# EAGLE design nixie_without_colon (EAGLE 7.7.0)
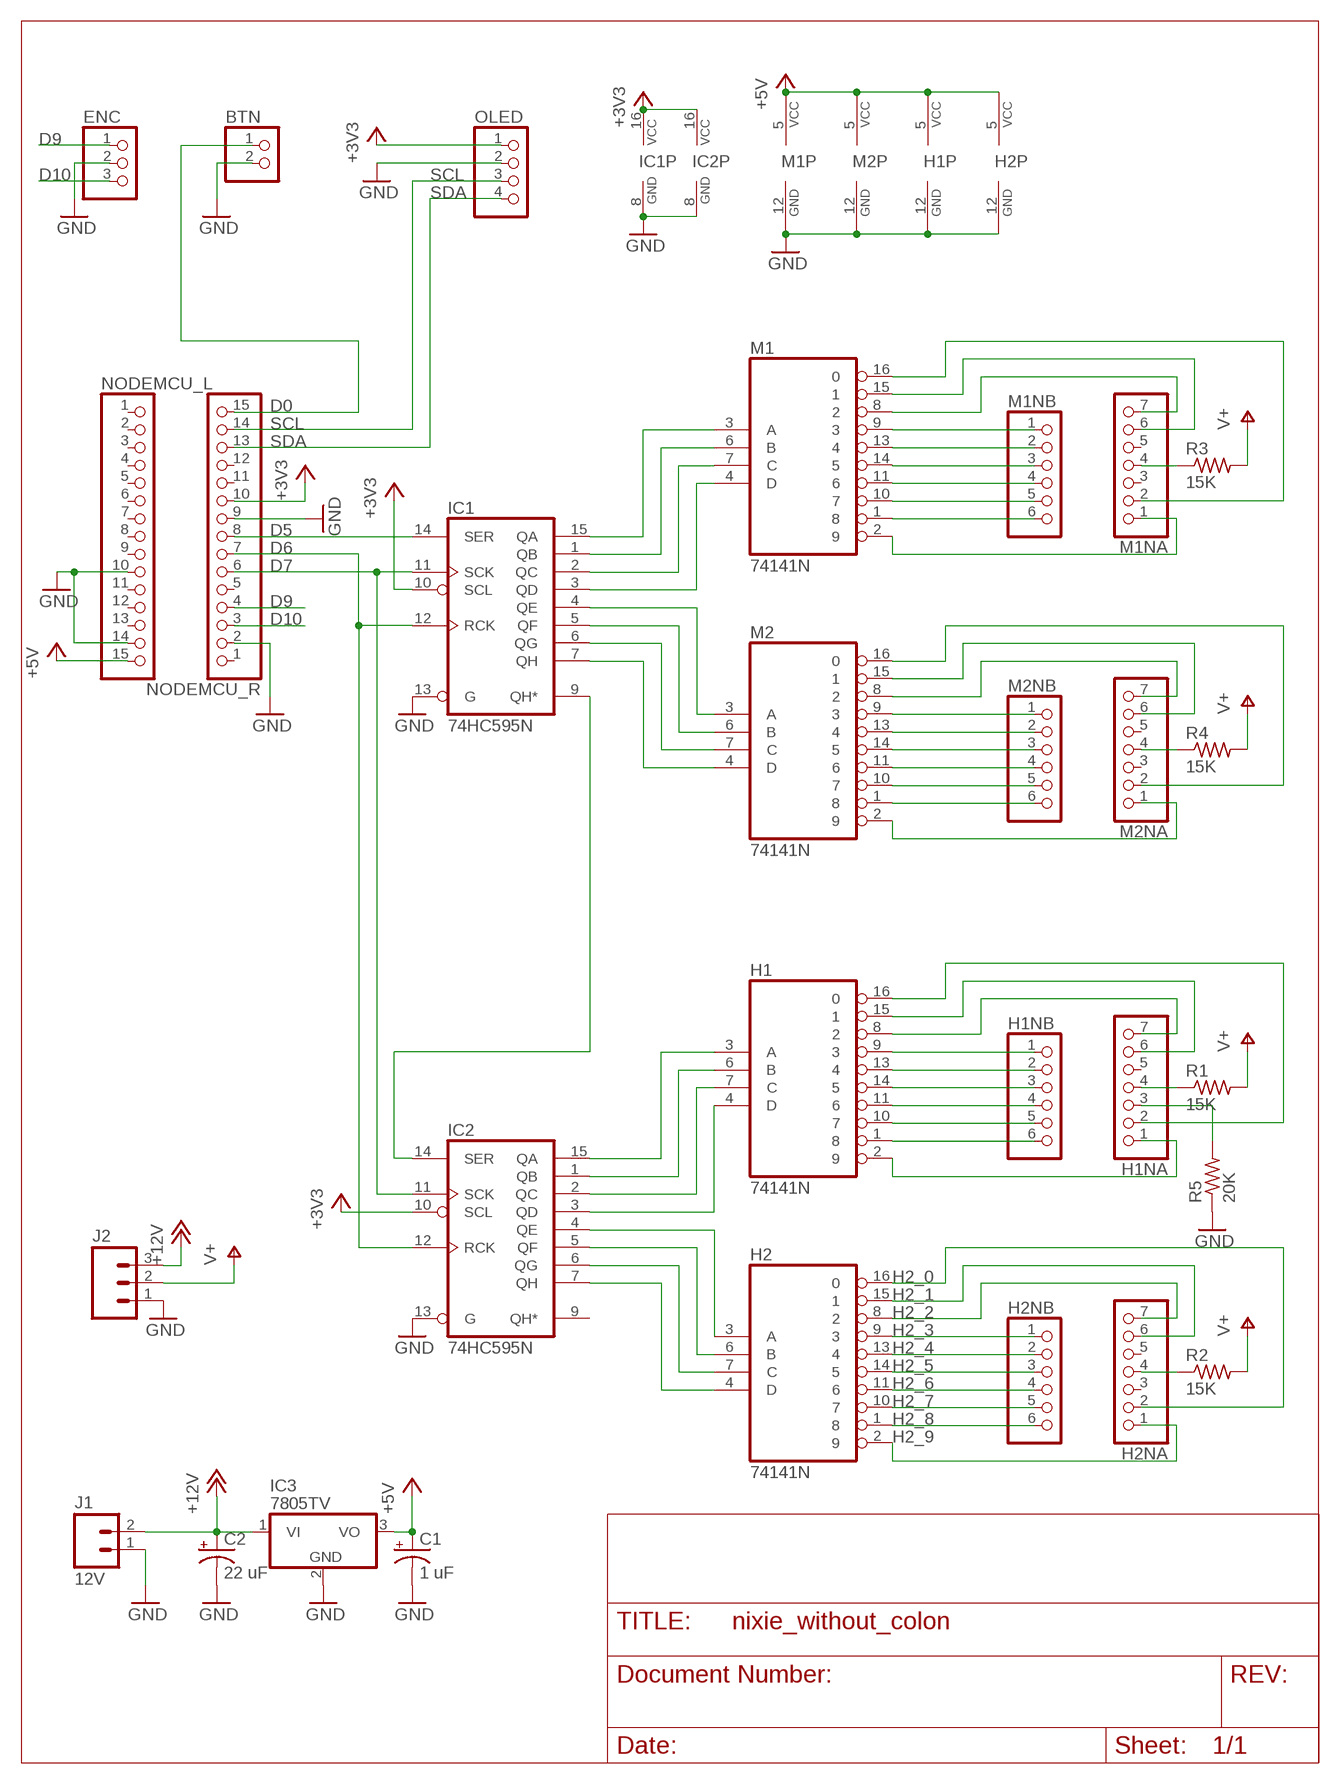
[diagram p0: schematic, sheet 1]

## Parts
BTN  PINHD-1X2  [1X02]
C1  1 uF  CPOL-USTT2D5  [TT2D5]
C2  22 uF  CPOL-USTT2D5  [TT2D5]
ENC  PINHD-1X3  [1X03]
H1  74141N  [DIL16]
H1NA  PINHD-1X7  [1X07]
H1NB  PINHD-1X6  [1X06]
H2  74141N  [DIL16]
H2NA  PINHD-1X7  [1X07]
H2NB  PINHD-1X6  [1X06]
IC1  74HC595N  [DIL16]
IC2  74HC595N  [DIL16]
IC3  7805TV  [TO220V]
J1  12V  M025MM  [SCREWTERMINAL-5MM-2]
J2  M03-SCREW-5MM  [SCREWTERMINAL-5MM-3]
M1  74141N  [DIL16]
M1NA  PINHD-1X7  [1X07]
M1NB  PINHD-1X6  [1X06]
M2  74141N  [DIL16]
M2NA  PINHD-1X7  [1X07]
M2NB  PINHD-1X6  [1X06]
NODEMCU_L  PINHD-1X15  [1X15]
NODEMCU_R  PINHD-1X15  [1X15]
OLED  PINHD-1X4  [1X04]
R1  15K  R-US_0207/10  [0207/10]
R2  15K  R-US_0207/10  [0207/10]
R3  15K  R-US_0207/10  [0207/10]
R4  15K  R-US_0207/10  [0207/10]
R5  20K  R-US_0207/10  [0207/10]

## Nets
+3V3: IC1.10(SCL) IC1.16(VCC) IC2.10(SCL) IC2.16(VCC) NODEMCU_R.10 OLED.1
+5V: C1.+ H1.5(VCC) H2.5(VCC) IC3.3(VO) M1.5(VCC) M2.5(VCC) NODEMCU_L.15
+12V: C2.+ IC3.1(VI) J1.2 J2.3
D0: BTN.1 NODEMCU_R.15
D5: IC1.14(SER) NODEMCU_R.8
D6: IC1.12(RCK) IC2.12(RCK) NODEMCU_R.7
D7: IC1.11(SCK) IC2.11(SCK) NODEMCU_R.6
D9: ENC.1 NODEMCU_R.4
D10: ENC.3 NODEMCU_R.3
GND: BTN.2 C1.- C2.- ENC.2 H1.12(GND) H2.12(GND) IC1.8(GND) IC1.13(G) IC2.8(GND) IC2.13(G) IC3.2(GND) J1.1 J2.1 M1.12(GND) M2.12(GND) NODEMCU_L.10 NODEMCU_L.14 NODEMCU_R.2 NODEMCU_R.9 OLED.2 R5.1
H2_0: H2.16 H2NA.2
H2_1: H2.15 H2NA.6
H2_2: H2.8 H2NA.7
H2_3: H2.9 H2NB.1
H2_4: H2.13 H2NB.2
H2_5: H2.14 H2NB.3
H2_6: H2.11 H2NB.4
H2_7: H2.10 H2NB.5
H2_8: H2.1 H2NB.6
H2_9: H2.2 H2NA.1
N$1: H1.16 H1NA.2
N$2: H1.2 H1NA.1
N$3: H1.9 H1NB.1
N$4: H1.13 H1NB.2
N$5: H1.14 H1NB.3
N$6: H1.11 H1NB.4
N$7: H1.10 H1NB.5
N$8: H1.1 H1NB.6
N$9: H1.8 H1NA.7
N$10: H1.15 H1NA.6
N$11: H1NA.4 R1.1
N$12: H1NA.3 R5.2
N$22: H2NA.4 R2.1
N$23: M1.16 M1NA.2
N$24: M1.9 M1NB.1
N$25: M1.13 M1NB.2
N$26: M1.14 M1NB.3
N$27: M1.11 M1NB.4
N$28: M1.10 M1NB.5
N$29: M1.1 M1NB.6
N$30: M1.2 M1NA.1
N$31: M1.8 M1NA.7
N$32: M1.15 M1NA.6
N$33: M1NA.4 R3.1
N$34: M2.16 M2NA.2
N$35: M2.9 M2NB.1
N$36: M2.13 M2NB.2
N$37: M2.14 M2NB.3
N$38: M2.11 M2NB.4
N$39: M2.10 M2NB.5
N$40: M2.1 M2NB.6
N$41: M2.2 M2NA.1
N$42: M2.8 M2NA.7
N$43: M2.15 M2NA.6
N$44: M2NA.4 R4.1
N$45: IC1.15(QA) M1.3(A)
N$46: IC1.1(QB) M1.6(B)
N$47: IC1.2(QC) M1.7(C)
N$48: IC1.3(QD) M1.4(D)
N$49: IC1.4(QE) M2.3(A)
N$50: IC1.5(QF) M2.6(B)
N$51: IC1.6(QG) M2.7(C)
N$52: IC1.7(QH) M2.4(D)
N$53: H1.3(A) IC2.15(QA)
N$54: H1.6(B) IC2.1(QB)
N$55: H1.7(C) IC2.2(QC)
N$56: H1.4(D) IC2.3(QD)
N$57: H2.3(A) IC2.4(QE)
N$58: H2.6(B) IC2.5(QF)
N$59: H2.7(C) IC2.6(QG)
N$60: H2.4(D) IC2.7(QH)
N$61: IC1.9(QH*) IC2.14(SER)
SCL: NODEMCU_R.14 OLED.3
SDA: NODEMCU_R.13 OLED.4
V+: J2.2 R1.2 R2.2 R3.2 R4.2
Unconnected: H1NA.5 H2NA.3 H2NA.5 IC2.9(QH*) M1NA.3 M1NA.5 M2NA.3 M2NA.5 NODEMCU_L.1 NODEMCU_L.2 NODEMCU_L.3 NODEMCU_L.4 NODEMCU_L.5 NODEMCU_L.6 NODEMCU_L.7 NODEMCU_L.8 NODEMCU_L.9 NODEMCU_L.11 NODEMCU_L.12 NODEMCU_L.13 NODEMCU_R.1 NODEMCU_R.5 NODEMCU_R.11 NODEMCU_R.12

## Library data of the parts
BTN = pinhead:PINHD-1X2: PIN HEADER
C1 C2 = rcl:CPOL-US: POLARIZED CAPACITOR, American symbol
ENC = pinhead:PINHD-1X3: PIN HEADER
H1 H2 M1 M2 = 74xx-us:74*141: BCD to decimal DECODER/DRIVER
H1NA H2NA M1NA M2NA = pinhead:PINHD-1X7: PIN HEADER
H1NB H2NB M1NB M2NB = pinhead:PINHD-1X6: PIN HEADER
IC1 IC2 = 74xx-eu:74*595: 8-bit SHIFT REGISTER, output latch
IC3 = linear:78*: Positive VOLTAGE REGULATOR Source: http://cache.national.com/ds/LM/LM78L05.pdf http://www.fairchildsemi.com/ds/LM/LM7805.pdf
J1 = SparkFun-Connectors:M02: Standard 2-pin 0.1" header. Use with - straight break away headers ( PRT-00116) - right angle break away headers (PRT-00553) - swiss pins (PRT-00743) - machine pins (PRT-00117) - female headers (PRT-00115) Molex polarized connector foot print use with: PRT-08233 with associated crimp pins and housings. 2.54_SCREWTERM for use with PRT-10571. 3.5mm Screw Terminal footprints for PRT-08084 5mm Screw Terminal footprints for use with PRT-08432; STOREFRONT_ID: PRT-08432
J2 = SparkFun-Connectors:M03: Header 3 Standard 3-pin 0.1" header. Use with straight break away headers (SKU : PRT-00116), right angle break away headers (PRT-00553), swiss pins (PRT-00743), machine pins (PRT-00117), and female headers (PRT-00115). Molex polarized connector foot print use with SKU : PRT-08232 with associated crimp pins and housings.; STOREFRONT_ID: PRT-08433
NODEMCU_L NODEMCU_R = pinhead:PINHD-1X15: PIN HEADER
OLED = pinhead:PINHD-1X4: PIN HEADER
R1-R5 = resistor:R-US_: RESISTOR, American symbol

## Board
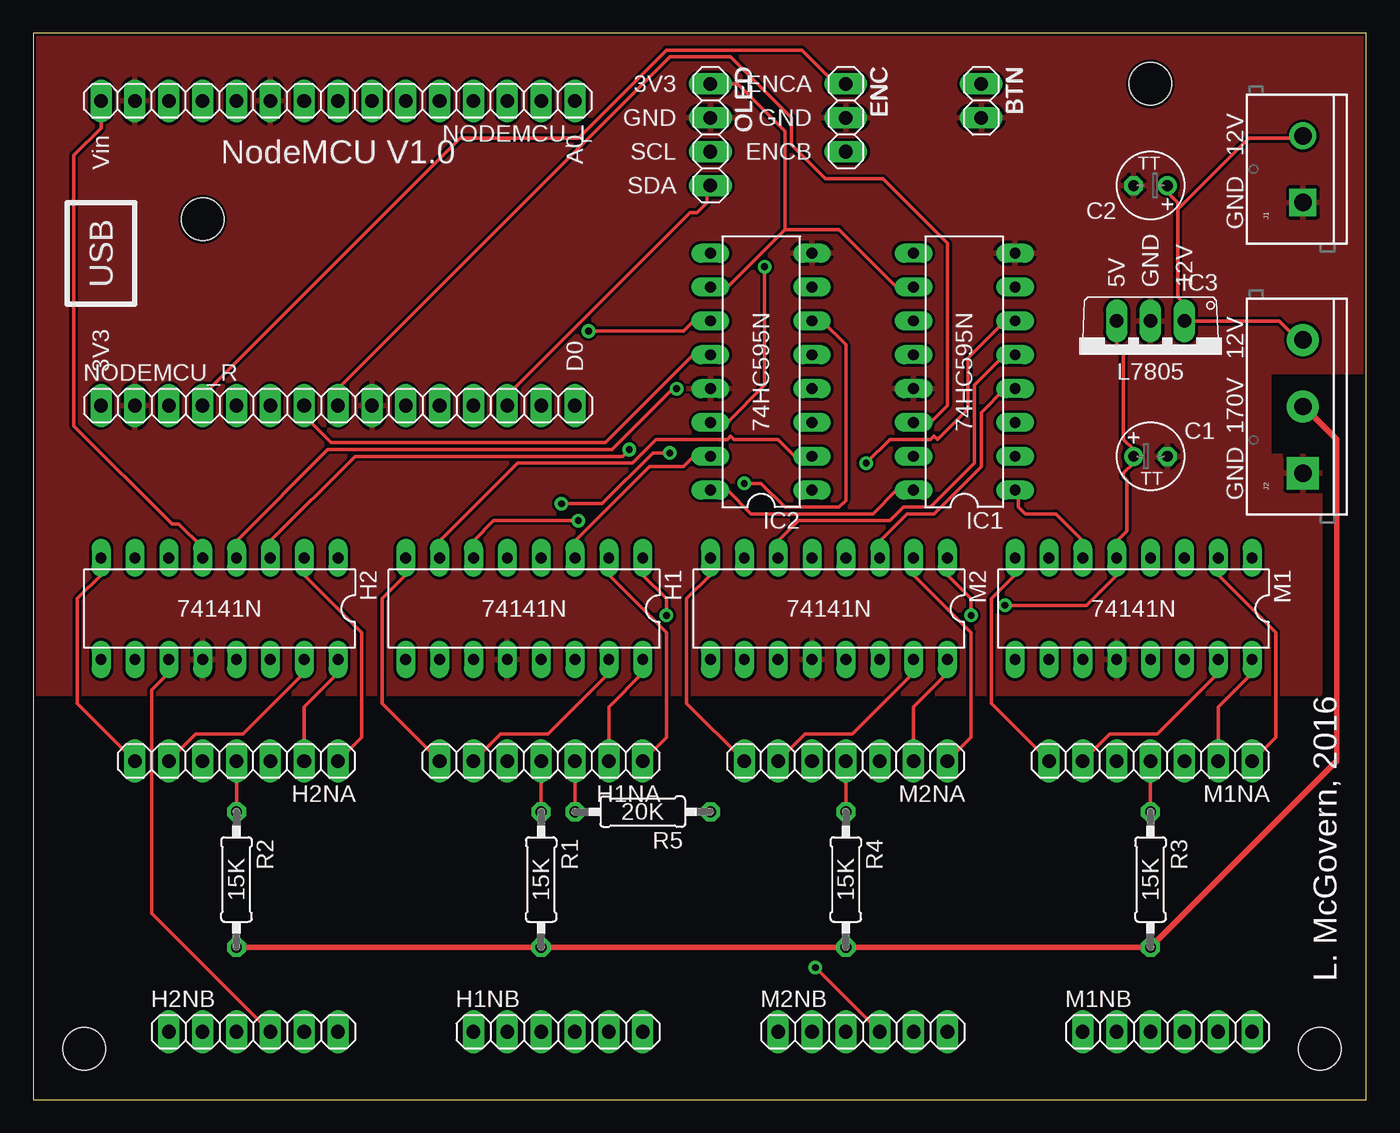
[diagram p1: board, top side]
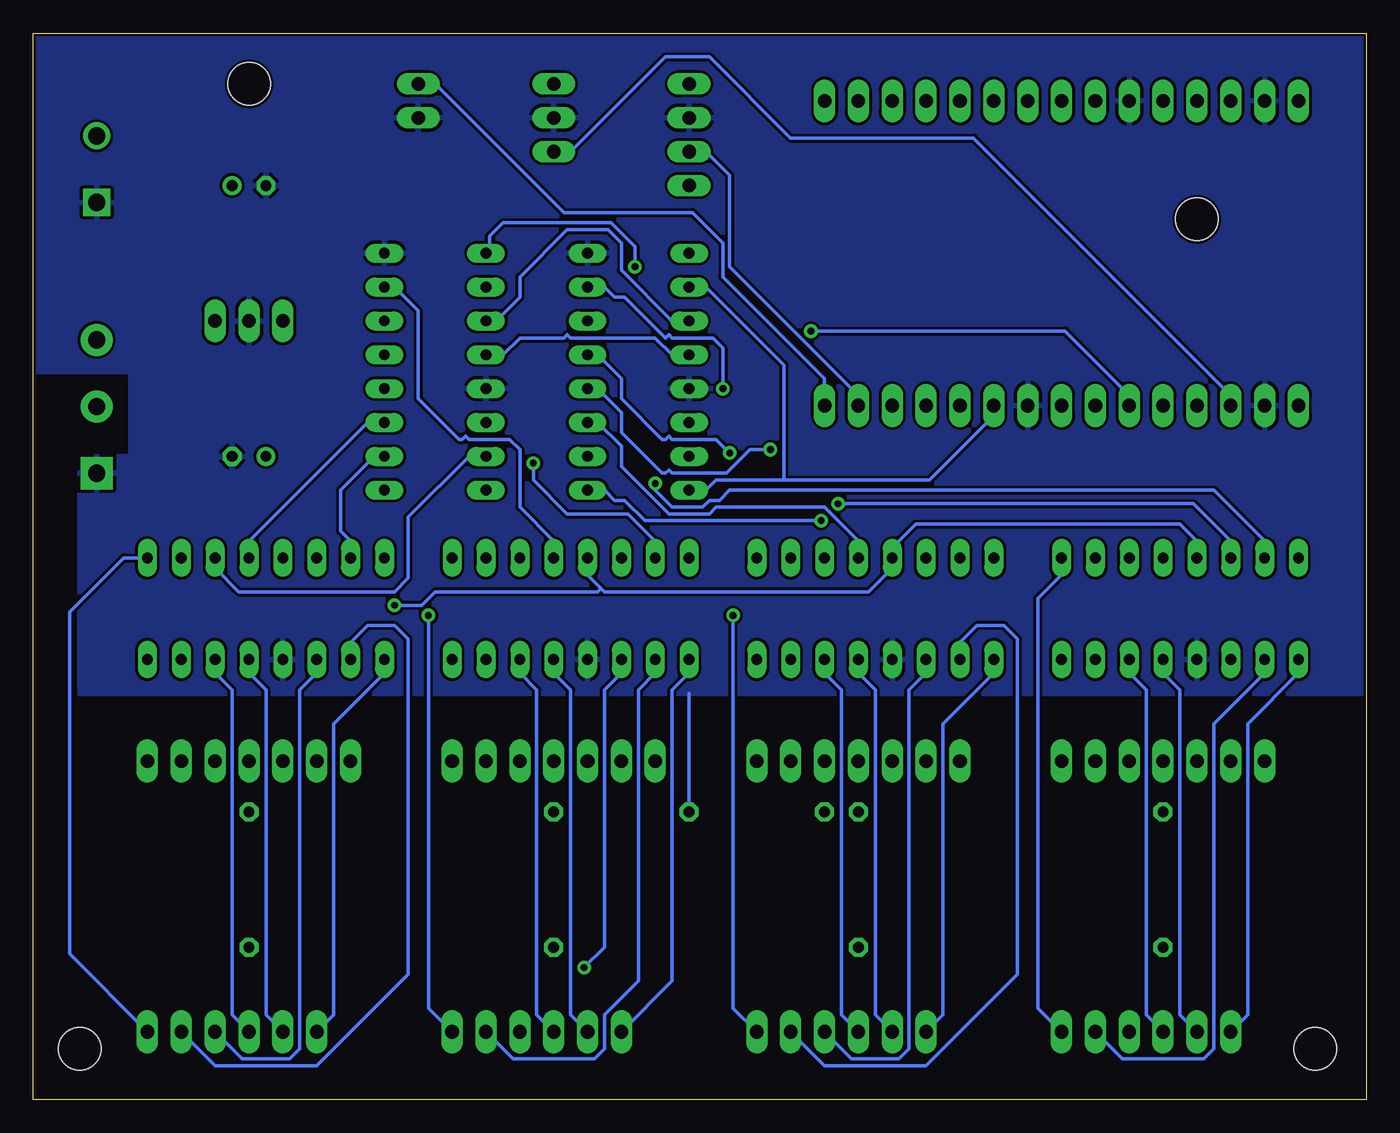
[diagram p2: board, bottom side, seen from below]

Size 100 x 80 mm. Coordinates in mm from the lower left corner, seen from the top.
Outline: 0,0 100,0 100,80 0,80 0,0
Copper layers (1*16): Top 0.035mm / dielectric 1.5mm / Bottom 0.035mm
Design rules "SparkFun *": minimum track width 10mil, minimum drill 20mil, track to track 8mil, track to pad 8mil, pad to pad 8mil, via to via 8mil, smd to smd 8mil, copper to edge 8mil, drill to drill 8mil, minimum pad ring 12mil, minimum via ring 10mil, stop-mask expansion 4mil, vias tented up to drill 20mil, thermal gap 10mil
Holes 3.2 mm at 3.81,3.81 96.52,3.81 12.7,66.04 83.82,76.2

### Footprints (pad centres in the part's own frame; a part is rotated, then mirrored left to right if it is on the bottom)
1X02 = drill 1.016 long: 1 -1.27,0; 2 1.27,0
TT2D5 = drill 0.813: + -1.27,0 | drill 0.813 octagon: - 1.27,0
1X03 = drill 1.016 long: 1 -2.54,0; 2 0,0; 3 2.54,0
DIL16 = drill 0.813 long: 1 -8.89,-3.81; 2 -6.35,-3.81; 3 -3.81,-3.81; 4 -1.27,-3.81; 5 1.27,-3.81; 6 3.81,-3.81; 7 6.35,-3.81; 8 8.89,-3.81; 9 8.89,3.81; 10 6.35,3.81; 11 3.81,3.81; 12 1.27,3.81; 13 -1.27,3.81; 14 -3.81,3.81; 15 -6.35,3.81; 16 -8.89,3.81
1X07 = drill 1.016 long: 1 -7.62,0; 2 -5.08,0; 3 -2.54,0; 4 0,0; 5 2.54,0; 6 5.08,0; 7 7.62,0
1X06 = drill 1.016 long: 1 -6.35,0; 2 -3.81,0; 3 -1.27,0; 4 1.27,0; 5 3.81,0; 6 6.35,0
TO220V = drill 1.016 long: 1 -2.54,-2.54; 2 0,-2.54; 3 2.54,-2.54
SCREWTERMINAL-5MM-2 = drill 1.3 pad 2.032 square: 1 0,0 | drill 1.3 pad 2.032: 2 5,0
SCREWTERMINAL-5MM-3 = drill 1.3 pad 2.413 square: 1 0,0 | drill 1.3 pad 2.413: 2 5,0; 3 10,0
1X15 = drill 1.016 long: 1 -17.78,0; 2 -15.24,0; 3 -12.7,0; 4 -10.16,0; 5 -7.62,0; 6 -5.08,0; 7 -2.54,0; 8 0,0; 9 2.54,0; 10 5.08,0; 11 7.62,0; 12 10.16,0; 13 12.7,0; 14 15.24,0; 15 17.78,0
1X04 = drill 1.016 long: 1 -3.81,0; 2 -1.27,0; 3 1.27,0; 4 3.81,0
0207/10 = drill 0.813 octagon: 1 -5.08,0; 2 5.08,0

### Placement (x,y rotation side)
BTN  71.12,74.93 270 top
C1  83.82,48.26 0 top
C2  83.82,68.58 180 top
ENC  60.96,73.66 270 top
H1  36.83,36.83 180 top
H1NA  38.1,25.4 180 top
H1NB  39.37,5.08 0 top
H2  13.97,36.83 180 top
H2NA  15.24,25.4 180 top
H2NB  16.51,5.08 0 top
IC1  69.85,54.61 90 top
IC2  54.61,54.61 90 top
IC3  83.82,55.88 180 top
J1  95.25,67.31 90 top
J2  95.25,46.99 90 top
M1  82.55,36.83 180 top
M1NA  83.82,25.4 180 top
M1NB  85.09,5.08 0 top
M2  59.69,36.83 180 top
M2NA  60.96,25.4 180 top
M2NB  62.23,5.08 0 top
NODEMCU_L  22.86,74.93 180 top
NODEMCU_R  22.86,52.07 0 top
OLED  50.8,72.39 270 top
R1  38.1,16.51 270 top
R2  15.24,16.51 270 top
R3  83.82,16.51 270 top
R4  60.96,16.51 270 top
R5  45.72,21.59 180 top

### Tracks (layer width: path | path; a pad name or v marks a point on that pad's centre or on a via)
+3V3
  Top 0.254: IC2.10 52.07,60.96 56.39,65.28 | 56.39,65.28 60.45,65.28 64.77,60.96 IC1.10 | OLED.1 52.83,76.2 56.39,72.64 56.39,65.28 | IC2.16 52.07,45.72 53.85,43.94 62.99,43.94 64.77,45.72 IC1.16
  Bottom 0.254: NODEMCU_R.10 27.94,51.31 32.77,46.48 43.69,46.48 | 43.69,46.48 48.77,46.48 49.53,45.72 IC2.16 | IC2.10 49.53,60.96 43.69,55.12 43.69,46.48
+5V  (via drill 0.51)
  Top 0.254: IC3.3 81.28,56.39 81.79,55.88 81.79,49.53 82.55,48.77 C1.+ 82.55,47.75 81.79,46.99 81.79,46.74 82.04,46.48 82.04,42.67 81.28,41.91 M1.5 81.28,39.37 78.99,37.08 v72.9,37.08 | NODEMCU_L.15 5.08,72.9 3.05,70.87 3.05,50.55 10.41,43.18 10.92,43.18 12.7,41.4 H2.5
  Bottom 0.254: H2.5 12.7,41.91 13.97,43.18 33.78,43.18 35.56,41.4 H1.5 35.56,39.88 37.34,38.1 57.15,38.1 57.4,38.35 | M2.5 58.42,39.37 57.4,38.35 | v72.9,37.08 70.87,37.08 69.85,38.1 57.66,38.1 57.4,38.35
+12V
  Top 0.254: C2.+ 85.09,68.07 85.85,67.31 85.85,66.8 | 85.85,66.8 85.85,60.2 86.36,59.69 IC3.1 93.47,58.42 94.74,57.15 95.25,57.15 J2.3 | 85.85,66.8 91.19,72.14 95.25,72.14 J1.2
D0
  Bottom 0.254: NODEMCU_R.15 40.64,54.1 48.26,61.72 48.26,64.26 50.55,66.55 60.2,66.55 69.85,76.2 BTN.1
D5
  Top 0.254: IC1.14 67.31,50.8 68.58,52.07 68.58,64.26 63.75,69.09 59.44,69.09 56.9,71.63 56.9,73.66 52.32,78.23 47.75,78.23 22.86,53.34 NODEMCU_R.8
D6
  Top 0.254: NODEMCU_R.7 20.32,51.31 22.35,49.28 42.93,49.28 49.53,55.88 IC2.12
  Bottom 0.254: IC2.12 52.07,55.88 53.34,57.15 59.69,57.15 59.94,57.4 60.2,57.15 63.5,57.15 64.77,55.88 IC1.12
D7  (via drill 0.51)
  Top 0.254: v41.66,57.66 48.77,57.66 49.53,58.42 IC2.11
  Bottom 0.254: IC2.11 52.07,58.42 55.88,62.23 55.88,64.26 56.9,65.28 59.94,65.28 63.5,61.72 63.5,60.2 65.28,58.42 IC1.11 | NODEMCU_R.6 17.78,52.83 22.61,57.66 v41.66,57.66
D9
  Top 0.254: NODEMCU_R.4 12.7,52.83 32,72.14 40.89,72.14 47.5,78.74 57.66,78.74 60.2,76.2 ENC.1
D10
  Bottom 0.254: NODEMCU_R.3 10.16,52.83 29.46,72.14 43.18,72.14 49.28,78.23 52.58,78.23 59.69,71.12 ENC.3
GND
  Bottom 0.254: 50.8,30.48 R5.1
  pour Top: 0,78.74 0,80.01 100.33,80.01 100.33,78.74 100.33,54.61 92.71,54.61 92.71,53.34 92.71,48.26 96.52,48.26 96.52,30.48 0,30.48
  pour Bottom: 0,30.48 0,80.01 100.33,80.01 100.33,78.74 100.33,54.61 92.71,54.61 92.71,48.26 96.52,48.26 96.52,30.48
H2_0
  Top 0.254: H2.16 22.86,32 20.32,29.46 H2NA.2
H2_1
  Top 0.254: H2.15 20.32,32 15.75,27.43 12.19,27.43 H2NA.6
H2_2
  Top 0.254: H2.8 5.08,39.37 3.3,37.59 3.3,29.72 H2NA.7
H2_3
  Bottom 0.254: H2.9 5.08,32 8.89,28.19 8.89,6.35 H2NB.1
H2_4
  Bottom 0.254: H2.13 15.24,32 13.97,30.73 13.97,6.35 H2NB.2
H2_5
  Bottom 0.254: H2.14 17.78,32 16.51,30.73 16.51,6.35 H2NB.3
H2_6
  Top 0.254: H2.11 10.16,32 8.89,30.73 8.89,13.97 H2NB.4
H2_7
  Bottom 0.254: H2.10 7.62,32 11.43,28.19 11.43,3.81 12.19,3.05 18.29,3.05 H2NB.5
H2_8
  Bottom 0.254: H2.1 22.86,39.37 24.64,37.59 24.64,6.86 H2NB.6
H2_9
  Top 0.254: H2.2 20.32,39.37 24.64,35.05 24.64,27.18 H2NA.1
N$1
  Top 0.254: H1.16 45.72,32 43.18,29.46 H1NA.2
N$2
  Top 0.254: H1.2 43.18,39.37 47.5,35.05 47.5,27.18 H1NA.1
N$3
  Bottom 0.254: H1.9 27.94,32 31.75,28.19 31.75,6.35 H1NB.1
N$4
  Bottom 0.254: H1.13 38.1,32 36.83,30.73 36.83,6.35 H1NB.2
N$5
  Bottom 0.254: H1.14 40.64,32 39.37,30.73 39.37,6.35 H1NB.3
N$6
  Bottom 0.254: H1.11 33.02,32 34.29,30.73 34.29,3.81 35.05,3.05 38.61,3.05 H1NB.4
N$7
  Bottom 0.254: H1.10 30.48,34.29 29.21,35.56 27.18,35.56 26.16,34.54 26.16,9.4 33.02,2.54 40.64,2.54 H1NB.5
N$8  (via drill 0.51)
  Top 0.254: H1.1 45.72,39.37 47.5,37.59 v47.5,36.32
  Bottom 0.254: v47.5,36.32 47.5,6.86 H1NB.6
N$9
  Top 0.254: H1.8 27.94,39.37 26.16,37.59 26.16,29.72 H1NA.7
N$10
  Top 0.254: H1.15 43.18,32 38.61,27.43 35.05,27.43 H1NA.6
N$11
  Top 0.254: H1NA.4 R1.1
N$12
  Top 0.254: H1NA.3 R5.2
N$22
  Top 0.254: H2NA.4 R2.1
N$23
  Top 0.254: M1.16 91.44,32 88.9,29.46 M1NA.2
N$24
  Bottom 0.254: M1.9 73.66,32 77.47,28.19 77.47,6.35 M1NB.1
N$25
  Bottom 0.254: M1.13 83.82,32 82.55,30.73 82.55,6.35 M1NB.2
N$26
  Bottom 0.254: M1.14 86.36,32 85.09,30.73 85.09,6.35 M1NB.3
N$27
  Bottom 0.254: M1.11 78.74,32 80.01,30.73 80.01,3.81 80.77,3.05 84.33,3.05 M1NB.4
N$28
  Bottom 0.254: M1.10 76.2,34.29 74.93,35.56 72.9,35.56 71.88,34.54 71.88,9.4 78.74,2.54 86.36,2.54 M1NB.5
N$29
  Bottom 0.254: M1.1 93.22,40.64 97.28,36.58 97.28,10.92 M1NB.6
N$30
  Top 0.254: M1.2 88.9,39.37 93.22,35.05 93.22,27.18 M1NA.1
N$31
  Top 0.254: M1.8 73.66,39.37 71.88,37.59 71.88,29.72 M1NA.7
N$32
  Top 0.254: M1.15 88.9,32 84.33,27.43 80.77,27.43 M1NA.6
N$33
  Top 0.254: M1NA.4 R3.1
N$34
  Top 0.254: M2.16 68.58,32 66.04,29.46 M2NA.2
N$35
  Bottom 0.254: M2.9 50.8,32 52.07,30.73 52.07,8.89 M2NB.1
N$36
  Bottom 0.254: M2.13 60.96,32 59.69,30.73 59.69,6.35 M2NB.2
N$37
  Bottom 0.254: M2.14 63.5,32 62.23,30.73 62.23,6.35 M2NB.3
N$38  (via drill 0.51)
  Top 0.254: M2NB.4 v58.67,9.91
  Bottom 0.254: M2.11 55.88,32 57.15,30.73 57.15,11.43 v58.67,9.91
N$39
  Bottom 0.254: M2.10 53.34,32 54.61,30.73 54.61,8.89 57.15,6.35 57.15,3.81 57.91,3.05 64.01,3.05 M2NB.5
N$40  (via drill 0.51)
  Top 0.254: M2.1 68.58,39.37 70.36,37.59 v70.36,36.32
  Bottom 0.254: v70.36,36.32 70.36,6.86 M2NB.6
N$41
  Top 0.254: M2.2 66.04,39.37 70.36,35.05 70.36,27.18 M2NA.1
N$42
  Top 0.254: M2.8 50.8,39.37 49.02,37.59 49.02,29.72 M2NA.7
N$43
  Top 0.254: M2.15 66.04,32 61.47,27.43 57.91,27.43 M2NA.6
N$44
  Top 0.254: M2NA.4 R4.1
N$45
  Bottom 0.254: IC1.15 67.31,48.26 71.88,43.69 71.88,39.12 72.9,38.1 84.58,38.1 86.36,39.88 M1.3
N$46
  Top 0.254: M1.6 78.74,41.91 76.71,43.94 74.42,43.94 73.91,44.45 73.91,45.47 IC1.1
N$47
  Bottom 0.254: M1.7 76.2,41.91 76.96,42.67 76.96,45.72 74.42,48.26 IC1.2
N$48
  Bottom 0.254: M1.4 83.82,41.91 74.93,50.8 IC1.3
N$49
  Top 0.254: M2.3 63.5,41.91 65.53,43.94 67.56,43.94 71.12,47.5 71.12,51.56 72.9,53.34 IC1.4
N$50
  Top 0.254: M2.6 55.88,41.91 57.4,43.43 64.26,43.43 65.28,44.45 67.31,44.45 70.61,47.75 70.61,53.59 72.9,55.88 IC1.5
N$51  (via drill 0.51)
  Top 0.254: v62.48,47.75 64.26,49.53 67.31,49.53 67.56,49.78 67.82,49.53 70.1,51.82 70.1,55.63 72.9,58.42 IC1.6
  Bottom 0.254: M2.7 53.34,41.91 55.37,43.94 59.94,43.94 62.48,46.48 v62.48,47.75
N$52
  Bottom 0.254: M2.4 60.96,41.91 63.5,44.45 63.5,48.77 64.26,49.53 67.31,49.53 67.56,49.78 67.82,49.53 68.07,49.53 71.12,52.58 71.12,59.18 72.9,60.96 IC1.7
N$53
  Top 0.254: H1.3 40.64,41.91 46.23,47.5 48.77,47.5 49.53,48.26 IC2.15
N$54  (via drill 0.51)
  Top 0.254: H1.6 33.02,41.91 34.54,43.43 v40.89,43.43
  Bottom 0.254: v40.89,43.43 54.1,43.43 55.63,44.96 56.39,44.96 57.15,45.72 IC2.1
N$55
  Top 0.254: H1.7 30.48,41.91 36.32,47.75 44.96,47.75 46.74,49.53 52.07,49.53 52.32,49.78 52.58,49.53 55.88,49.53 57.15,48.26 IC2.2
N$56
  Bottom 0.254: H1.4 38.1,41.91 40.64,44.45 48.77,44.45 49.28,43.94 52.32,43.94 55.88,47.5 55.88,49.02 57.66,50.8 IC2.3
N$57  (via drill 0.51)
  Top 0.254: H2.3 17.78,41.91 24.13,48.26 44.2,48.26 v44.7,48.77
  Bottom 0.254: v44.7,48.77 46.23,48.77 48.01,46.99 52.07,46.99 52.32,47.24 52.58,46.99 52.83,46.99 55.88,50.04 55.88,51.56 57.66,53.34 IC2.4
N$58  (via drill 0.51)
  Top 0.254: v39.62,44.7 42.67,44.7 46.48,48.51 v47.75,48.51
  Bottom 0.254: H2.6 10.16,41.91 12.95,44.7 v39.62,44.7 | v47.75,48.51 48.77,49.53 52.07,49.53 52.32,49.78 52.58,49.53 52.83,49.53 55.88,52.58 55.88,54.1 57.66,55.88 IC2.5
N$59  (via drill 0.51)
  Top 0.254: v53.34,46.23 54.61,46.23 56.39,44.45 60.45,44.45 60.96,44.96 60.96,56.64 59.18,58.42 IC2.6
  Bottom 0.254: H2.7 7.62,41.91 11.43,45.72 47.75,45.72 48.51,44.96 49.28,44.96 49.78,44.45 52.07,44.45 53.34,45.72 v53.34,46.23
N$60  (via drill 0.51)
  Top 0.254: H2.4 15.24,41.91 22.1,48.77 43.43,48.77 48.01,53.34 v48.26,53.34
  Bottom 0.254: v48.26,53.34 48.26,56.39 49.02,57.15 52.07,57.15 52.32,57.4 52.58,57.15 55.63,60.2 56.39,60.2 57.15,60.96 IC2.7
N$61  (via drill 0.51)
  Top 0.254: IC2.14 52.07,50.8 54.86,53.59 v54.86,62.48
  Bottom 0.254: v54.86,62.48 54.86,64.01 56.64,65.79 64.77,65.79 65.79,64.77 65.79,63.75 IC1.9
SCL
  Bottom 0.254: NODEMCU_R.14 38.1,52.83 47.75,62.48 47.75,69.34 49.53,71.12 OLED.3
SDA
  Top 0.254: NODEMCU_R.13 35.56,52.83 49.28,66.55 49.78,66.55 50.55,67.31 50.55,68.33 OLED.4
V+
  Top 0.406: J2.2 95.33,51.99 97.79,49.53 97.79,25.4 R3.2 R4.2 R1.2 R2.2

### Text on the board
tPlace: OLED | ENC | BTN | 3V3 | ENCA | GND | GND | Vin | A0 | 12V | NodeMCU V1.0 | SCL | ENCB | SDA | GND | USB | 5V | GND | 12V | 12V | 3V3 | D0 | 74HC595N | 74HC595N | L7805 | 170V | GND | 74141N | 74141N | 74141N | 74141N | 20K | 15K | 15K | 15K | 15K | L. McGovern, 2016